# Altium schematic sheet E73N30.SchDoc
size 431 x 279 mm; SheetNumber: 1; SheetTotal: 1
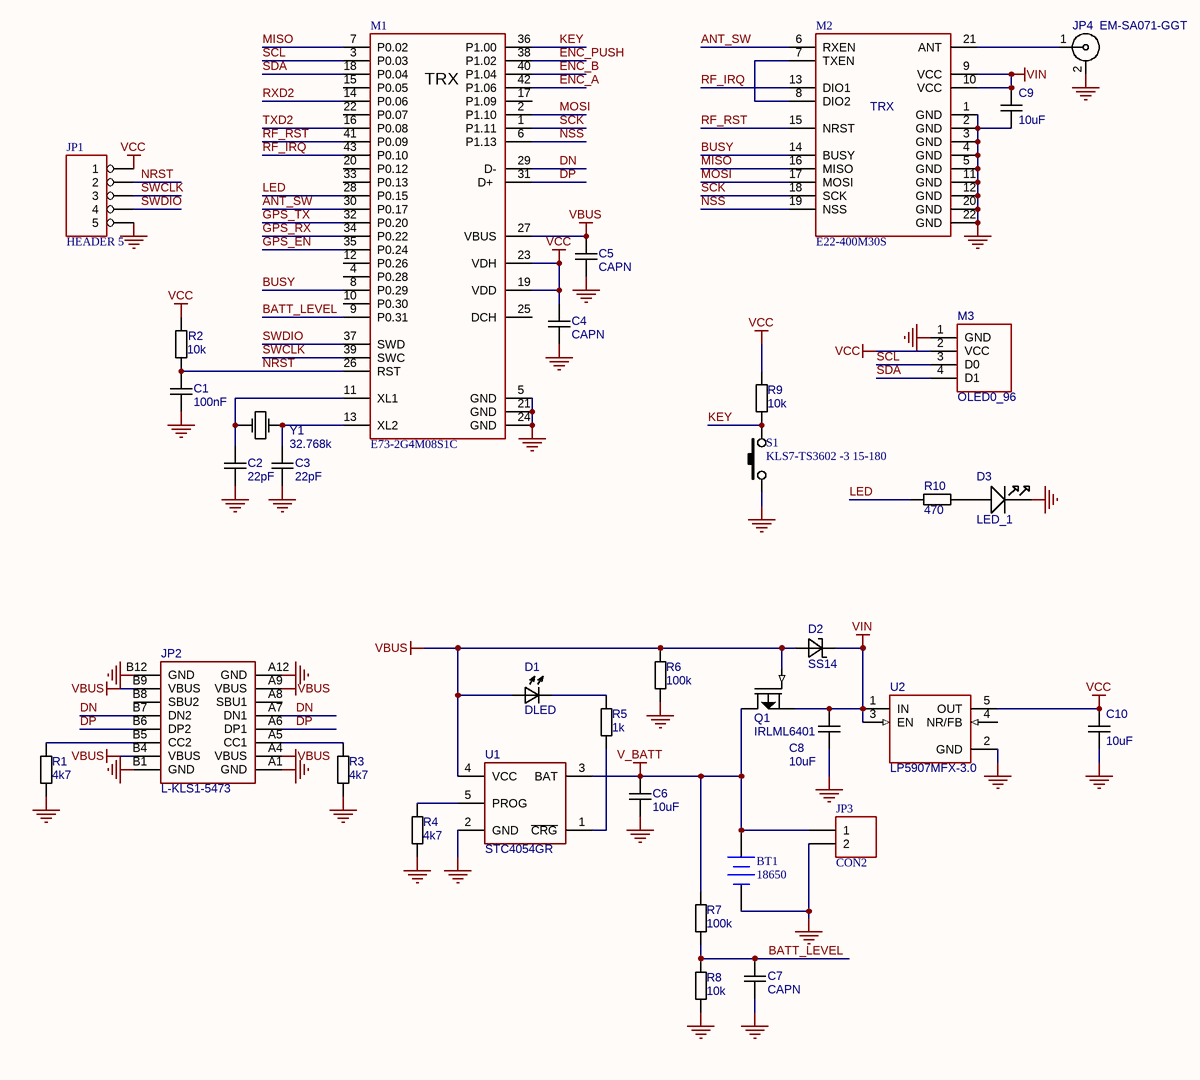
[diagram p0: E73N30.SchDoc]

## Parts
BT1  18650  [18650]
C1  100nF  [C-0603]
C2  22pF  [C-0603]
C3  22pF  [C-0603]
C4  CAPN  [C-0603]
C5  CAPN  [C-0603]
C6  10uF  [C-0805]
C7  CAPN  [C-0603]
C8  10uF  [C-0805]
C9  10uF  [C-0805]
C10  10uF  [C-0805]
D1  DLED  [LED0805]
D2  SS14  [D-SMA]
D3  LED_1  [LED_0805]
JP1  HEADER 5  [PLS1-5]
JP2  L-KLS1-5473  [USB_C_SMD_SLOT]
JP3  CON2  [WH-02R]
JP4  EM-SA071-GGT  [SMA_F_EDGE]
M1  E73-2G4M08S1C  [E73-2G4M08S1CX]
M2  E22-400M30S  [PE22(400M30S)]
M3  OLED0_96  [OLED096_I2C]
Q1  IRLML6401  [SOT-23]
R1  4k7  [R-0603]
R2  10k  [R-0603]
R3  4k7  [R-0603]
R4  4k7  [R-0603]
R5  1k  [R-0603]
R6  100k  [R-0603]
R7  100k  [R-0603]
R8  10k  [R-0603]
R9  10k  [R-0603]
R10  470  [R-0603]
S1  KLS7-TS3602 -3 15-180  [KN_MIN]
U1  STC4054GR  [SOT-23-5]
U2  LP5907MFX-3.0  [SOT-23-5]
Y1  32.768k  [KX-327]

## Nets
GND: BT1.2(-) C1.1 C2.1 C3.1 C4.2 C5.2 C6.2 C7.2 C8.2 C9.2 C10.2 D3.K(CATHODE) JP1.5 JP2.A1(GND) JP2.A12(GND) JP2.B1(GND) JP2.B12(GND) JP3.2 JP4.2 M1.5(GND) M1.21(GND) M1.24(GND) M2.1(GND) M2.2(GND) M2.3(GND) M2.4(GND) M2.5(GND) M2.11(GND) M2.12(GND) M2.20(GND) M2.22(GND) M3.1(GND) R1.1 R3.1 R4.1 R6.1 R8.1 S1.1 U1.2(GND) U2.2(GND)
V_BATT: BT1.1(+) C6.1 JP3.1 Q1.3(DRAIN) R7.2 U1.3(BAT)
VBUS: C5.1 D1.1 D2.1 JP2.A4(VBUS) JP2.A9(VBUS) JP2.B4(VBUS) JP2.B9(VBUS) M1.27(VBUS) Q1.1(GATE) R6.2 U1.4(VCC)
VCC: C4.1 C10.1 JP1.1 M1.19(VDD) M1.23(VDH) M3.2(VCC) R2.2 R9.1 U2.5(OUT)
VIN: C8.1 C9.1 D2.2 M2.9(VCC) M2.10(VCC) Q1.2(SOURCE) U2.1(IN) U2.3(EN)
ANT_SW: M1.30(P0.17) M2.6(RXEN)
BATT_LEVEL: C7.1 M1.9(P0.31) R7.1 R8.2
BUSY: M1.8(P0.29) M2.14(BUSY)
DN: JP2.A7(DN1) JP2.B7(DN2) M1.29(D-)
DP: JP2.A6(DP1) JP2.B6(DP2) M1.31(D+)
ENC_A: M1.42(P1.06)
ENC_B: M1.40(P1.04)
ENC_PUSH: M1.38(P1.02)
GPS_EN: M1.35(P0.24)
GPS_RX: M1.34(P0.22)
GPS_TX: M1.32(P0.20)
KEY: M1.36(P1.00) R9.2 S1.2
LED: M1.28(P0.15) R10.2
MISO: M1.7(P0.02) M2.16(MISO)
MOSI: M1.2(P1.10) M2.17(MOSI)
NRST: C1.2 JP1.2 M1.26(RST) R2.1
NSS: M1.6(P1.13) M2.19(NSS)
RF_IRQ: M1.43(P0.10) M2.13(DIO1)
RF_RST: M1.41(P0.09) M2.15(NRST)
RXD2: M1.14(P0.06)
SCK: M1.1(P1.11) M2.18(SCK)
SCL: M1.3(P0.03) M3.3(D0)
SDA: M1.18(P0.04) M3.4(D1)
SWCLK: JP1.3 M1.39(SWC)
SWDIO: JP1.4 M1.37(SWD)
TXD2: M1.16(P0.08)
NetC2_2: C2.2 M1.11(XL1) Y1.2
NetC3_2: C3.2 M1.13(XL2) Y1.1
NetD1_2: D1.2 R5.2
NetD3_A: D3.A(ANODE) R10.1
NetJP2_A5: JP2.A5(CC1) R3.2
NetJP2_B5: JP2.B5(CC2) R1.2
NetJP4_1: JP4.1 M2.21(ANT)
NetM2_7: M2.7(TXEN) M2.8(DIO2)
NetR4_2: R4.2 U1.5(PROG)
NetR5_1: R5.1 U1.1(~{CRG})

Not connected (* = marked no-connect by the designer): JP2 17(VSS) A8(SBU1) B8(SBU2); M1 4(P0.28) 10(P0.30) 12(P0.26) 15(P0.05) 17(P1.09) 20(P0.12) 22(P0.07) 25(DCH) 33(P0.13); U2 4(NR/FB)

## Notes on the sheet
- DWG. NO.
- REV.
- SHT.
- THIS DOCUMENT AND THE DATA DISCLOSED HEREIN OR HEREWITH IS THE PROPERTY OF ALTIUM LIMITED AND MAY BE FREELY DISTRIBUTED IN WHOLE. NO RIGHTS ARE RESERVED OR EXPRESS OR IMPLIED WARANTEE GIVEN.
- REVISION
- DESCRIPTION
- DATE
- APPROVED
- ENG:
- APPROVALS
- PROJECT
- DSN:
- CHK:
- REFERENCE DOCUMENTS
- PROJECT REVISION:
- TITLE
- DOCUMENT REVISION:
- DESIGN ITEM:
- BOM:
- FAB DWG:
- PCB DWG:
- ASSY DWG:
- SCALE:
- SIZE
- B
- CAGE CODE
- FILE NAME
- DWG NO.
- SHEET
- OF
- REV
- (in symbol E22) TRX
- (in symbol E73-2G4M08S1C) TRX

## Library data of the parts
BT1 = Battery: Multicell Battery; Published: 24-Mar-1999; LatestRevisionDate: 17-Jul-2002; LatestRevisionNote: Re-released for DXP Platform.; PackageReference: BAT-2; Publisher: Altium Limited; PackageDescription: Battery; 2 Leads; Value: 18650
C1-C10 = CAPN: Voltage: 50V; Точність/група: NP0; Вид: Конденсатор
D1 = DLED: Вид: Світлодіод
D2 = DIODSH: Вид: Діод
D3 = LED_1: Вид: Світлодіод
JP1 = HEADER 5: Вид: Роз'єм; *: *
JP2 = L-KLS1-5473: Mounting  Method: SMD; Value: *
JP3 = CON2: Вид: Роз'єм; *: *
JP4 = SMA: SMA Female R/A PCB Mount; Вид: Роз'єм
M2 = E22
M3 = OLED0_96_I2C
Q1 = MOSF-P: Вид: Транзистор
R1-R10 = RES: Точність/група: 5%; Вид: Резистор
S1 = SW-1: Вид: Кнопка; Робоча напруга: *
U1 = STC4054
U2 = LP5907: 250mA Low-Dropout Regulator; Вид: Мікросхема
Y1 = Y: Точність/група: 20ppm; Вид: Кварц